# Altium schematic sheet MCU.SchDoc: MCU Learning
size A4; DrawnBy: Kalihotname; Revision: 1.0; SheetNumber: 1; SheetTotal: 2
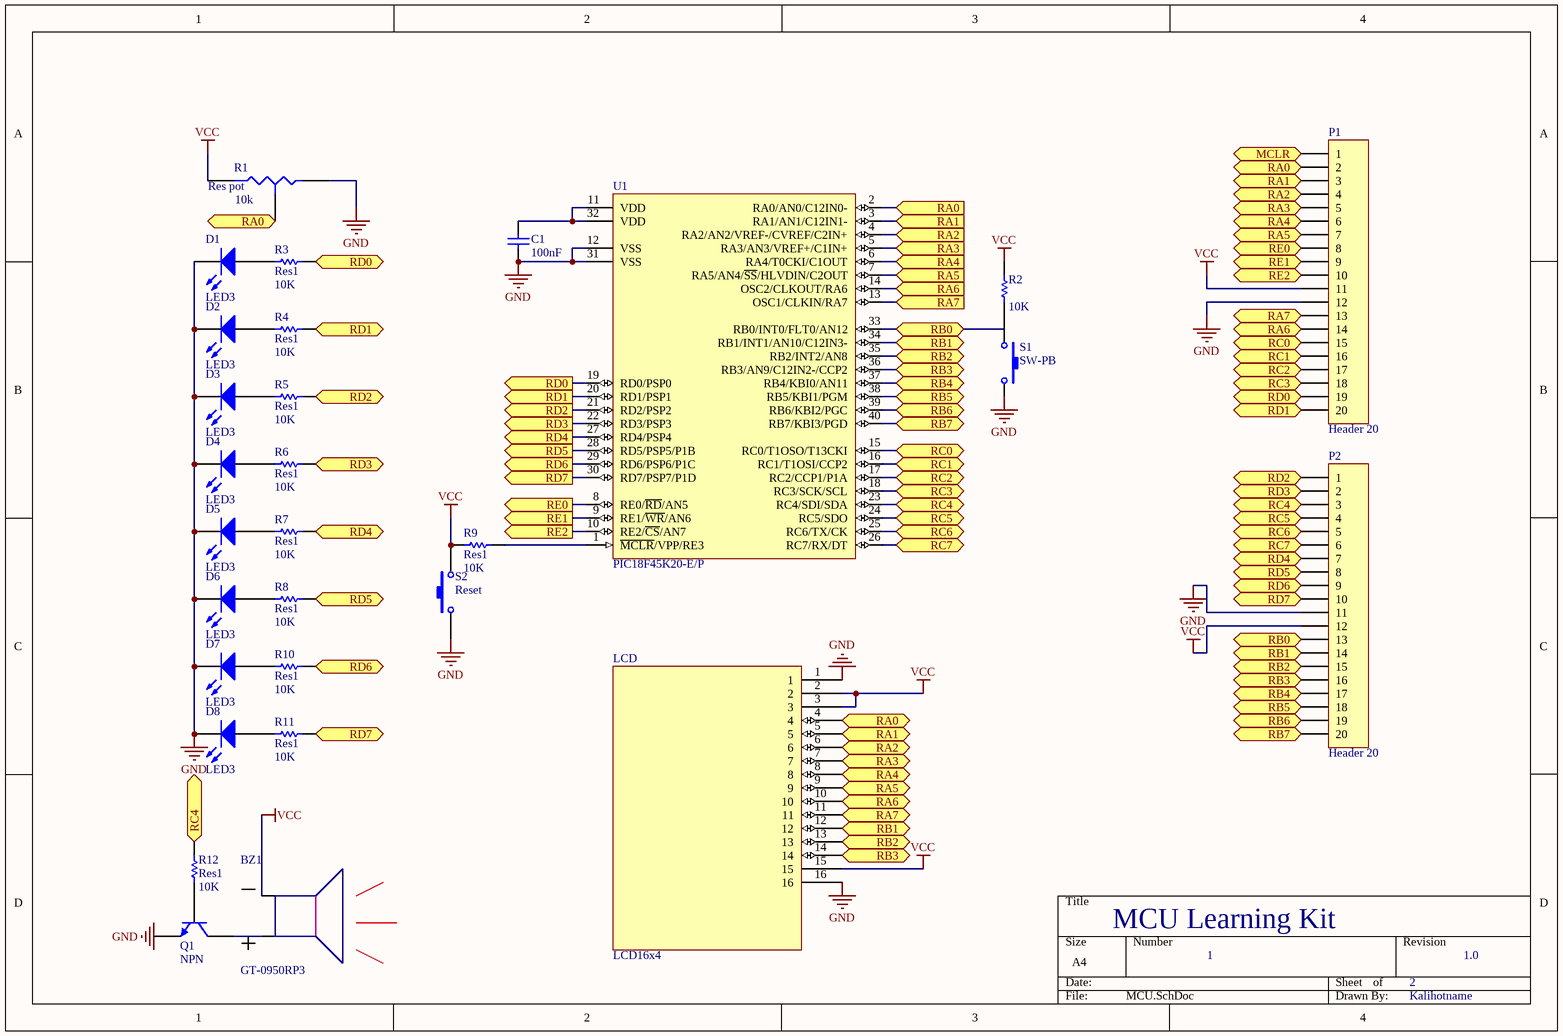
[diagram p0: MCU.SchDoc]

## Parts
BZ1  GT-0950RP3  [Buzzer]
C1  value 100nF  [CAPC1005M]  (hidden comment: Cap)
D1  LED3  [3.5X2.8X1.9]
D2  LED3  [3.5X2.8X1.9]
D3  LED3  [3.5X2.8X1.9]
D4  LED3  [3.5X2.8X1.9]
D5  LED3  [3.5X2.8X1.9]
D6  LED3  [3.5X2.8X1.9]
D7  LED3  [3.5X2.8X1.9]
D8  LED3  [3.5X2.8X1.9]
LCD  LCD16x4  [PCBComponent_1]
P1  Header 20  [HDR1X20]
P2  Header 20  [HDR1X20]
Q1  NPN  [SOT23-3M]
R1  Res pot  value 10k  [RPOT]
R2  value 10K  [RESC1005M]  (hidden comment: Res1)
R3  Res1  value 10K  [RESC1005M]
R4  Res1  value 10K  [RESC1005M]
R5  Res1  value 10K  [RESC1005M]
R6  Res1  value 10K  [RESC1005M]
R7  Res1  value 10K  [RESC1005M]
R8  Res1  value 10K  [RESC1005M]
R9  Res1  value 10K  [RESC1005M]
R10  Res1  value 10K  [RESC1005M]
R11  Res1  value 10K  [RESC1005M]
R12  Res1  value 10K  [RESC1005M]
S1  SW-PB  [SPST-2]
S2  Reset  [SPST-2]
U1  PIC18F45K20-E/P  [PDIP600-P40]

## Ports
MCLR, RA0 (in), RA1 (in), RA2 (in), RA3 (in), RA4 (in), RA5 (in), RA6 (in), RA7 (in), RB0, RB1, RB2, RB3, RB4, RB5, RB6, RB7, RC0, RC1, RC2, RC3, RC4, RC5, RC6, RC7, RD0 (out), RD1 (out), RD2 (out), RD3 (out), RD4 (out), RD5 (out), RD6 (out), RD7 (out), RE0 (out), RE1 (out), RE2 (out)

## Nets
GND: C1.1 D1.2(K) D2.2(K) D3.2(K) D4.2(K) D5.2(K) D6.2(K) D7.2(K) D8.2(K) LCD.1 LCD.16 P1.12 P2.11 R1.1(A) S2.1 U1.12(VSS) U1.31(VSS)
VCC: BZ1.1 LCD.2 LCD.3 LCD.15 P1.11 P2.12 R1.2(B) R2.1 R9.2 S2.2
MCLR: P1.1 ; port MCLR
RA0: LCD.4 P1.2 R1.3(TAP) U1.2(RA0/AN0/C12IN0-) ; port RA0
RA1: LCD.5 P1.3 U1.3(RA1/AN1/C12IN1-) ; port RA1
RA2: LCD.6 P1.4 U1.4(RA2/AN2/VREF-/CVREF/C2IN+) ; port RA2
RA3: LCD.7 P1.5 U1.5(RA3/AN3/VREF+/C1IN+) ; port RA3
RA4: LCD.8 P1.6 U1.6(RA4/T0CKI/C1OUT) ; port RA4
RA5: LCD.9 P1.7 U1.7(RA5/AN4/~{SS}/HLVDIN/C2OUT) ; port RA5
RA6: LCD.10 P1.14 U1.14(OSC2/CLKOUT/RA6) ; port RA6
RA7: LCD.11 P1.13 U1.13(OSC1/CLKIN/RA7) ; port RA7
RB0: P2.13 U1.33(RB0/INT0/FLT0/AN12) ; port RB0
RB1: LCD.12 P2.14 U1.34(RB1/INT1/AN10/C12IN3-) ; port RB1
RB2: LCD.13 P2.15 U1.35(RB2/INT2/AN8) ; port RB2
RB3: LCD.14 P2.16 U1.36(RB3/AN9/C12IN2-/CCP2) ; port RB3
RB4: P2.17 U1.37(RB4/KBI0/AN11) ; port RB4
RB5: P2.18 U1.38(RB5/KBI1/PGM) ; port RB5
RB6: P2.19 U1.39(RB6/KBI2/PGC) ; port RB6
RB7: P2.20 U1.40(RB7/KBI3/PGD) ; port RB7
RC0: P1.15 U1.15(RC0/T1OSO/T13CKI) ; port RC0
RC1: P1.16 U1.16(RC1/T1OSI/CCP2) ; port RC1
RC2: P1.17 U1.17(RC2/CCP1/P1A) ; port RC2
RC3: P1.18 U1.18(RC3/SCK/SCL) ; port RC3
RC4: P2.3 R12.2 U1.23(RC4/SDI/SDA) ; port RC4
RC5: P2.4 U1.24(RC5/SDO) ; port RC5
RC6: P2.5 U1.25(RC6/TX/CK) ; port RC6
RC7: P2.6 U1.26(RC7/RX/DT) ; port RC7
RD0: P1.19 R3.1 U1.19(RD0/PSP0) ; port RD0
RD1: P1.20 R4.1 U1.20(RD1/PSP1) ; port RD1
RD2: P2.1 R5.1 U1.21(RD2/PSP2) ; port RD2
RD3: P2.2 R6.1 U1.22(RD3/PSP3) ; port RD3
RD4: P2.7 R7.1 U1.27(RD4/PSP4) ; port RD4
RD5: P2.8 R8.1 U1.28(RD5/PSP5/P1B) ; port RD5
RD6: P2.9 R10.1 U1.29(RD6/PSP6/P1C) ; port RD6
RD7: P2.10 R11.1 U1.30(RD7/PSP7/P1D) ; port RD7
RE0: P1.8 U1.8(RE0/~{RD}/AN5) ; port RE0
RE1: P1.9 U1.9(RE1/~{WR}/AN6) ; port RE1
RE2: P1.10 U1.10(RE2/~{CS}/AN7) ; port RE2
NetBZ1_2: BZ1.2 Q1.1(C)
NetC1_2: C1.2 U1.11(VDD) U1.32(VDD)
NetD1_1: D1.1(A) R3.2
NetD2_1: D2.1(A) R4.2
NetD3_1: D3.1(A) R5.2
NetD4_1: D4.1(A) R6.2
NetD5_1: D5.1(A) R7.2
NetD6_1: D6.1(A) R8.2
NetD7_1: D7.1(A) R10.2
NetD8_1: D8.1(A) R11.2
NetQ1_2: Q1.2(B) R12.1
NetR2_2: R2.2 S1.1
NetR9_1: R9.1 U1.1(~{MCLR}/VPP/RE3)

Not connected (* = marked no-connect by the designer): Q1 3(E); S1 2

## Notes on the sheet
- MCU Learning Kit
- 1
- 2
- 1.0
- Labels drawn without touching a wire or pin: GND

## Library data of the parts
BZ1 = Buzzer: AUDIO MAGNETICXDCR
C1 = Cap: CAP CER 0.1uF 50V 0805; Published: 8-Jun-2000; LatestRevisionDate: 17-Jul-2002; LatestRevisionNote: Re-released for DXP Platform.; PackageReference: RAD-0.3; Publisher: Altium Limited
D1-D8 = LED3: Typical BLUE SiC LED; Published: 8-Jun-2000; LatestRevisionDate: 17-Dec-2003; LatestRevisionNote: PCB Footprint replaced.; DatasheetDocument: 16-Apr-2002; PackageDocument: 16-Apr-2002; PackageReference: 3.5X2.8X1.9; Publisher: Altium Limited
P1 P2 = Header 20: Header, 20-Pin; LatestRevisionDate: 17-Jul-2002; LatestRevisionNote: Re-released for DXP Platform.; Publisher: Altium Limited
Q1 = NPN: NPN Bipolar Transistor; Published: 8-Jun-2000; LatestRevisionDate: 17-Jul-2002; LatestRevisionNote: Re-released for DXP Platform.; PackageReference: TO-226; Publisher: Altium Limited; Code_JEDEC: TO-226-AA
R1 = Res Tap: Tapped Resistor; Sim Note: Enter the Resistance value and the set point into parameter fields.; Set Position: 0.5; Published: 24-Mar-1999; LatestRevisionDate: 17-Jul-2002; LatestRevisionNote: Re-released for DXP Platform.; PackageReference: VR3; Publisher: Altium Limited
R2-R12 = Res1: Resistor 10k 5% 1/8W 8050; Published: 8-Jun-2000; LatestRevisionDate: 17-Jul-2002; LatestRevisionNote: Re-released for DXP Platform.; PackageReference: AXIAL-0.3; Publisher: Altium Limited
S1 S2 = SW-PB: Switch; Published: 24-Mar-1999; LatestRevisionDate: 17-Jul-2002; LatestRevisionNote: Re-released for DXP Platform.; PackageReference: SPST-2; Publisher: Altium Limited
U1 = PIC18F45K20-E/P: Flash Microcontroller with 10-Bit A/D and nanoWatt Technology, 32K Flash, 40-Pin PDIP, Extended Temperature Range; Published: 29-Jan-2009; LatestRevisionDate: 02-Dec-2009; LatestRevisionNote: Updated to datasheet revision F, Sep-2009; DatasheetVersion: revF, Sep-2009; PackageVersion: revBB, Aug-2009; PackageReference: PDIP600-P40; Publisher: Altium Limited; PackageDescription: 40-Lead Plastic Dual In-Line (P) - 600 mil Body [PDIP]; Supplier 1: Digi-Key; Supplier Part Number 1: PIC18F45K20-E/P-ND; ComponentLink1Description: Datasheet; ComponentLink1URL: http://ww1.microchip.com/downloads/en/DeviceDoc/41303F.pdf; ComponentLink2Description: Packaging Specification; ComponentLink2URL: http://www.microchip.com/stellent/groups/techpub_sg/documents/packagingspec/en012702.pdf; ComponentLink3Description: Microchip.com Home; ComponentLink3URL: http://www.microchip.com/